# Altium schematic sheet Leg.SchDoc
size A4
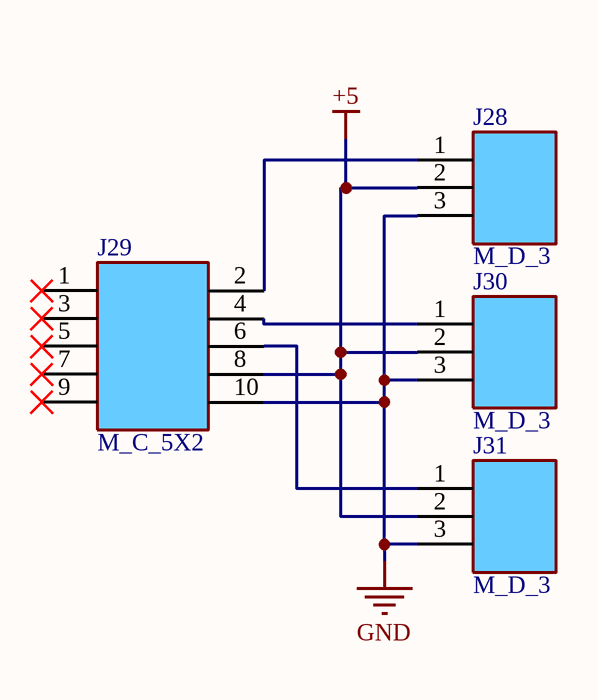
[diagram p0: Leg.SchDoc]

## Parts
J28  Type: M_D_3  [BARRETTE_3_M_D]  (hidden comment: BARRETTE 3 CONTACTS 1 RANGEE MALE DROITE)
J29  Type: M_C_5X2  [BARRETTE_5X2_M_C]  (hidden comment: BARRETTE_5 CONTACTS_2 RANGEES_MALE_COUDEE)
J30  Type: M_D_3  [BARRETTE_3_M_D]  (hidden comment: BARRETTE 3 CONTACTS 1 RANGEE MALE DROITE)
J31  Type: M_D_3  [BARRETTE_3_M_D]  (hidden comment: BARRETTE 3 CONTACTS 1 RANGEE MALE DROITE)

## Nets
+5: J28.2 J29.8 J30.2 J31.2
GND: J28.3 J29.10 J30.3 J31.3
NetJ28_1: J28.1 J29.2
NetJ29_4: J29.4 J30.1
NetJ29_6: J29.6 J31.1

Not connected (* = marked no-connect by the designer): J29 1* 3* 5* 7* 9*

## Library data of the parts
J28 J30 J31 = BARRETTE_3 CONTACTS_1 RANGEE_MALE_DROITE
J29 = BARRETTE_5 CONTACTS_2 RANGEES_MALE_COUDEE: BARRETTE 5 CONTACTS 2 RANGEES MALE COUDEE